# Altium schematic sheet audio_io.SchDoc
size A3; SheetNumber: 13; SheetTotal: 13
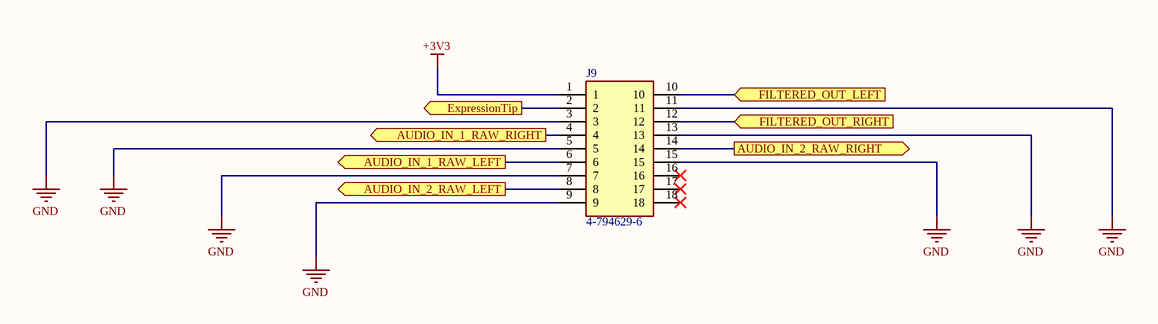
[diagram p0: audio_io.SchDoc]

## Parts
J9  4-794629-6  [47946296]

## Ports
AUDIO_IN_1_RAW_LEFT (out, see high_level[7B], Input_Output_Filtering[3B]), AUDIO_IN_1_RAW_RIGHT (out, see high_level[7B], Input_Output_Filtering[3C]), AUDIO_IN_2_RAW_LEFT (out, see high_level[7C], Input_Output_Filtering[3A]), AUDIO_IN_2_RAW_RIGHT (out, see high_level[7B], Input_Output_Filtering[3B]), ExpressionTip (out, see high_level[7B], Expression_Pedal[3B]), FILTERED_OUT_LEFT (in, see high_level[7C], Input_Output_Filtering[6D]), FILTERED_OUT_RIGHT (in, see high_level[7C], Input_Output_Filtering[6D])

## Nets
+3V3: J9.1
GND: J9.3 J9.5 J9.7 J9.9 J9.11 J9.13 J9.15
AUDIO_IN_1_RAW_LEFT: J9.6 ; port AUDIO_IN_1_RAW_LEFT
AUDIO_IN_1_RAW_RIGHT: J9.4 ; port AUDIO_IN_1_RAW_RIGHT
AUDIO_IN_2_RAW_LEFT: J9.8 ; port AUDIO_IN_2_RAW_LEFT
AUDIO_IN_2_RAW_RIGHT: J9.14 ; port AUDIO_IN_2_RAW_RIGHT
ExpressionTip: J9.2 ; port ExpressionTip
FILTERED_OUT_LEFT: J9.10 ; port FILTERED_OUT_LEFT
FILTERED_OUT_RIGHT: J9.12 ; port FILTERED_OUT_RIGHT

Not connected (* = marked no-connect by the designer): J9 16* 17* 18*

## Library data of the parts
J9 = 4-794629-6: Connector; Manufacturer_Name: TE Connectivity; Datasheet Link: https://www.te.com/commerce/DocumentDelivery/DDEController?Action=srchrtrv&DocNm=micro-mate-n-lok-connector-qrg&DocType=Data%20Sheet&DocLang=English&PartCntxt=4-794629-6&DocFormat=pdf; Height: 8.67mm; Manufacturer_Part_Number: 4-794629-6; Mouser Part Number: 571-4-794629-6; Mouser Price/Stock: https://www.mouser.co.uk/ProductDetail/TE-Connectivity-AMP/4-794629-6?qs=vczR1Rbrl535QN5OwRvF4g%3D%3D; Arrow Part Number: 4-794629-6; Arrow Price/Stock: https://www.arrow.com/en/products/4-794629-6/te-connectivity?region=nac